# Altium schematic sheet RFID Reader Chip.SchDoc
size A3; SheetNumber: 5; SheetTotal: 8
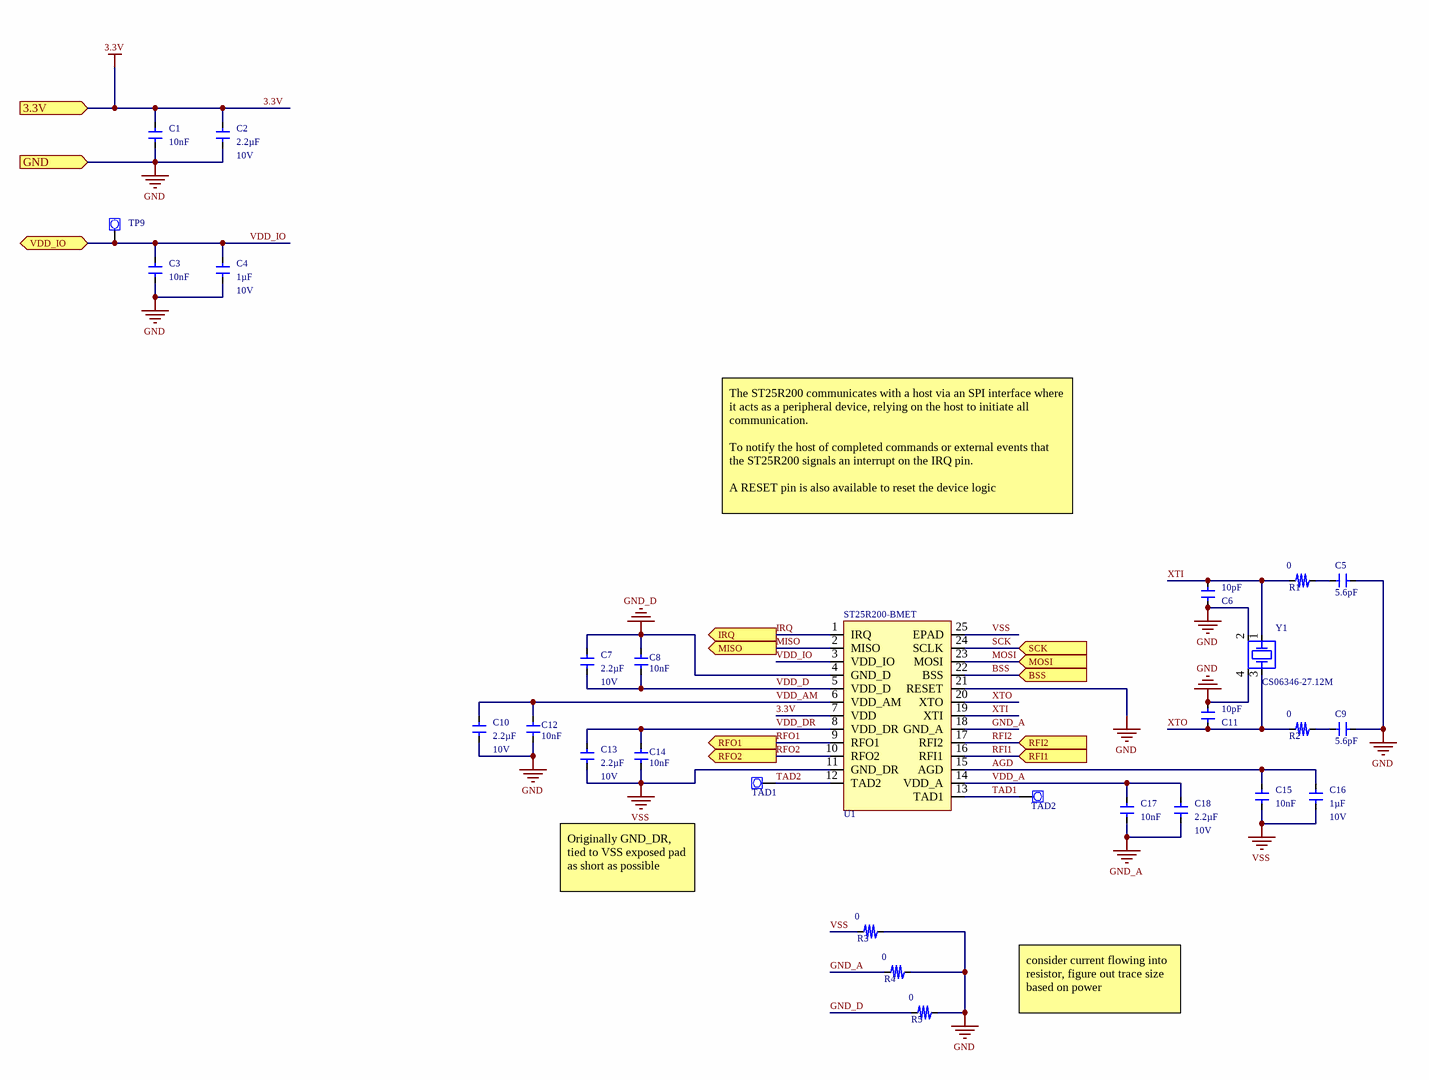
[diagram p0: RFID Reader Chip.SchDoc]

## Parts
?  (no value)  (graphical)
C1  value 10nF  [SYK-STD-CAP-0603]  (hidden comment: SYK-CAP-GEN-0.01uF-10%-X7R-16V-0603)
C2  value 2.2µF  Voltage Rating: 10V  [SYK-STD-CAP-0805 - NOSILK]  (hidden comment: C0805C225K8RACTU)
C3  value 10nF  [SYK-STD-CAP-0603]  (hidden comment: SYK-CAP-GEN-0.01uF-10%-X7R-16V-0603)
C4  value 1µF  Voltage Rating: 10V  [SYK-STD-CAP-0805 - NOSILK]  (hidden comment: CL21B105KPFNNNE)
C5  value 5.6pF  [SYK-STD-CAP-0201]  (hidden comment: GRM0335C1H5R6BA01D)
C6  value 10pF  [SYK-STD-CAP-0603]  (hidden comment: SYK-CAP-GEN-10pF-5%-C0G-50V-0603)
C7  value 2.2µF  Voltage Rating: 10V  [SYK-STD-CAP-0805 - NOSILK]  (hidden comment: C0805C225K8RACTU)
C8  value 10nF  [SYK-STD-CAP-0603]  (hidden comment: SYK-CAP-GEN-0.01uF-10%-X7R-16V-0603)
C9  value 5.6pF  [SYK-STD-CAP-0201]  (hidden comment: GRM0335C1H5R6BA01D)
C10  value 2.2µF  Voltage Rating: 10V  [SYK-STD-CAP-0805 - NOSILK]  (hidden comment: C0805C225K8RACTU)
C11  value 10pF  [SYK-STD-CAP-0603]  (hidden comment: SYK-CAP-GEN-10pF-5%-C0G-50V-0603)
C12  value 10nF  [SYK-STD-CAP-0603]  (hidden comment: SYK-CAP-GEN-0.01uF-10%-X7R-16V-0603)
C13  value 2.2µF  Voltage Rating: 10V  [SYK-STD-CAP-0805 - NOSILK]  (hidden comment: C0805C225K8RACTU)
C14  value 10nF  [SYK-STD-CAP-0603]  (hidden comment: SYK-CAP-GEN-0.01uF-10%-X7R-16V-0603)
C15  value 10nF  [SYK-STD-CAP-0603]  (hidden comment: SYK-CAP-GEN-0.01uF-10%-X7R-16V-0603)
C16  value 1µF  Voltage Rating: 10V  [SYK-STD-CAP-0805 - NOSILK]  (hidden comment: CL21B105KPFNNNE)
C17  value 10nF  [SYK-STD-CAP-0603]  (hidden comment: SYK-CAP-GEN-0.01uF-10%-X7R-16V-0603)
C18  value 2.2µF  Voltage Rating: 10V  [SYK-STD-CAP-0805 - NOSILK]  (hidden comment: C0805C225K8RACTU)
R1  value 0  [SYK-STD-RES-0603]  (hidden comment: ERJ3GEY0R00V)
R2  value 0  [SYK-STD-RES-0603]  (hidden comment: ERJ3GEY0R00V)
R3  value 0  [SYK-STD-RES-0603]  (hidden comment: ERJ3GEY0R00V)
R4  value 0  [SYK-STD-RES-0603]  (hidden comment: ERJ3GEY0R00V)
R5  value 0  [SYK-STD-RES-0603]  (hidden comment: ERJ3GEY0R00V)
TAD1  40 mil Circular Test Point Pad  [TESTPOINT_40]  (value not drawn)
TAD2  40 mil Circular Test Point Pad  [TESTPOINT_40]  (value not drawn)
TP9  40 mil Circular Test Point Pad  [TESTPOINT_40]  (value not drawn)
U1  ST25R200-BMET  [ST MICRO UFQFPN24]
Y1  CS06346-27.12M  [NDK 4-SMD]

## Ports
3.3V (in), BSS (in), GND (in), IRQ (out), MISO (out), MOSI (in), RFI1 (in), RFI2 (in), RFO1 (out), RFO2 (out), SCK (in), VDD_IO (bidir)

## Nets
3.3V: C1.2 C2.2 U1.7(VDD) ; port 3.3V
GND: C1.1 C2.1 C3.1 C4.1 C5.1 C6.1 C9.1 C10.1 C11.2 C12.1 R3.1 R4.1 R5.1 U1.21(RESET) Y1.2 Y1.4 ; port GND
GND_A: C17.1 C18.1 R4.2 U1.18(GND_A)
GND_D: C7.2 C8.1 R5.2 U1.4(GND_D)
VSS: C13.1 C14.1 C15.1 C16.1 R3.2 U1.11(GND_DR) U1.25(EPAD)
AGD: C15.2 C16.2 U1.15(AGD)
BSS: U1.22(BSS) ; port BSS
IRQ: U1.1(IRQ) ; port IRQ
MISO: U1.2(MISO) ; port MISO
MOSI: U1.23(MOSI) ; port MOSI
RFI1: U1.16(RFI1) ; port RFI1
RFI2: U1.17(RFI2) ; port RFI2
RFO1: U1.9(RFO1) ; port RFO1
RFO2: U1.10(RFO2) ; port RFO2
SCK: U1.24(SCLK) ; port SCK
TAD1: TAD2.1(TSTPNT) U1.13(TAD1)
TAD2: TAD1.1(TSTPNT) U1.12(TAD2)
VDD_A: C17.2 C18.2 U1.14(VDD_A)
VDD_AM: C10.2 C12.2 U1.6(VDD_AM)
VDD_D: C7.1 C8.2 U1.5(VDD_D)
VDD_DR: C13.2 C14.2 U1.8(VDD_DR)
VDD_IO: C3.2 C4.2 TP9.1(TSTPNT) U1.3(VDD_IO) ; port VDD_IO
XTI: C6.2 R1.2 U1.19(XTI) Y1.1
XTO: C11.1 R2.2 U1.20(XTO) Y1.3
NetC5_2: C5.2 R1.1
NetC9_2: C9.2 R2.1

## Notes on the sheet
- The ST25R200 communicates with a host via an SPI interface where it acts as a peripheral device, relying on the host to initiate all communication.
  To notify the host of completed commands or external events that the ST25R200 signals an interrupt on the IRQ pin.
  A RESET pin is also available to reset the device logic
- Originally GND_DR, tied to VSS exposed pad as short as possible
- consider current flowing into resistor, figure out trace size based on power
- LAYER NAME
- CRITICAL QUALITY ATTRIBUTE
- TITLE NAME
- THIS DRAWING CONTAINS CONFIDENTIAL INFORMATION AND IS ISSUED IN CONFIDENCE ON THE CONDITIONS
  THAT IT BE RETURNED ON DEMAND AND NOT BE COPIED, REPRODUCED, DISCLOSED TO OTHERS OR USED
  IN THE MANUFACTURE OF THE SUBJECT-MATTER THEREOF WITHOUT THE WRITTEN CONSENT OF
  STRYKER CORPORATION.
- SHALL BE COMPLIANT PER ES-1168 AND ES-1005
- SHEET
- OF
- NUMBER
- REV
- APPROVALS ARE FOUND IN PLM SYSTEM

## Library data of the parts
? = CMP-001-0000-v0.01.17: Stryker standard title block with pre-parameterized fields
C1 C3 C8 C12 C14 C15 C17 = CMP-001-00003-v0.01.05: Ceramic Capacitor, Multilayer, Ceramic, 16V, 10% +Tol, 10% -Tol, X7R, 15% TC, 0.01uF, Surface Mount, 0603; Manufacturer: Generic; Voltage Rating: 50V; Case/Package: 0603 (1608 Metric); Length: 1.6mm; Moisture Sensitivity Level: -; Operating Temperature - Min: -55°C; Width: 0.8mm; Height: 0.8mm; Reach Compliant: Unaffected; Capacitor Type: Ceramic; Tolerance: 10%; Temperature Coefficient: X7R; Manufacturer Part Number: Generic; Pins: 2; Ratings: -; RoHS Compliant: Yes; Operating Temperature - Max: 125°C; Mounting Technology: SMT; Critical Component: -
C2 C7 C10 C13 C18 = CMP-001-0753-v0.01.00: CAP CER 2.2UF 10V X7R 0805; Manufacturer: KEMET; Device Length: 2mm; Device Width: 1.25mm; Tolerance: 10%; Style Guide Revision: Librarian to Review; Capacitor Type: Ceramic; Mounting Technology: SMT; Moisture Sensitivity Level: 1; Ratings: -; Operating Temperature - Max: 125°C; Pins: 2; Case/Package: 0805 (2012 Metric); Temperature Coefficient: X7R; Critical Component: -; Manufacturer Part Number: C0805C225K8RACTU; REACH Compliant: Unaffected; Device Height: 1.25mm; Operating Temperature - Min: -55°C; RoHS Compliant: Yes
C4 C16 = CMP-001-0752-v0.01.00: CAP CER 1UF 10V X7R 0805; Manufacturer: Samsung Electro-Mechanics; Device Width: 1.25mm; Tolerance: 10%; Style Guide Revision: Librarian to Review; Device Height: 1.35mm; Device Length: 2mm; Capacitor Type: Ceramic; Mounting Technology: SMT; Pins: 2; Ratings: -; Temperature Coefficient: X7R; Moisture Sensitivity Level: 1; Case/Package: 0805 (2012 Metric); REACH Compliant: Unaffected; Critical Component: -; RoHS Compliant: Yes; Operating Temperature - Max: 125°C; Manufacturer Part Number: CL21B105KPFNNNE; Operating Temperature - Min: -55°C
C5 C9 = CMP-001-0278-v0.01.00: CAP CER 5.6PF 50V C0G/NP0 0201; Manufacturer: Murata Electronics; Device Height: 300µm; Tolerance: 0.1%; Style Guide Revision: Librarian to Review; Temperature Coefficient: C0G, NP0; Device Length: 600µm; Capacitor Type: Ceramic; Manufacturer Part Number: GRM0335C1H5R6BA01D; Operating Temperature - Max: 125°C; RoHS Compliant: Yes; Device Width: 300µm; Pins: 2; REACH Compliant: Unaffected; Ratings: -; Mounting Technology: Surface Mount; Moisture Sensitivity Level: 1; Critical Component: -; Voltage Rating: 50V; Case/Package: 0201 (0603 Metric); Operating Temperature - Min: -55°C
C6 C11 = CMP-00698-v0.01.02: CAP CER 10pF 5% C0G 50V 0603; Manufacturer: Generic; Device Width: 800µm; Style Guide Revision: AA; Device Length: 1.6mm; Capacitor Type: Ceramic; Voltage Rating: 50V; Mounting Technology: SMT; REACH Compliant: Unaffected; RoHS Compliant: Yes; Operating Temperature - Max: 125°C; Ratings: -; Temperature Coefficient: C0G; Operating Temperature - Min: -55°C; Case/Package: 0603; Tolerance: 5%; Pins: 2; Manufacturer Part Number: Generic; Moisture Sensitivity Level: 1; Critical Component: -; Device Height: 800µm
R1-R5 = CMP-001-0150-v0.01.08: RES SMD 0 OHM JUMPER 1/10W 0603; Manufacturer: PANASONIC (GENERIC); Style Guide Revision: AA; Device Width: 500µm; Tolerance: 0%; Power: 100mW; Device Length: 1mm; Device Height: 400µm; Operating Temperature - Max: 155°C; Manufacturer Part Number: ERJ3GEY0R00V; REACH Compliant: Unaffected; Mounting Technology: SMT; Pin Count: 2; Temperature Coefficient: -; Critical Component: -; Case/Package: 0603; Operating Temperature - Min: -55°C; RoHS Compliant: Yes
TAD1 TAD2 TP9 = CMP-001-0175-v0.01.07: Manufacturer: Stryker; Manufacturer Part Number: Copper Feature; Device Width: 0mm; Plating: 0; Test Point Signal Structure: Unknown; Test Point Is Used: X; Style Guide Revision: Librarian to Review; Critical Component: -; RoHS Compliance: Unknown; Material - Insulation: 0; Operating Temperature - Max: 0°C; Color: n/a; Device Height: 0mm; Operating Temperature - Min: 0°C; Hole Diameter: 0mm; Device Length: 0mm; Device Height Above Board: 0mm; Pin Count: 1; REACH Compliance: Unknown; Material - Body: 0; Mounting Technology: SMT
U1 = CMP-001-0762-v0.01.00: IC RFID READER 27.12MHZ 24-UFQFN; Manufacturer: STMicroelectronics; Voltage - Supply (Min): 2.7V; Device Height: 600µm; Voltage - Supply (Max): 5.5V; Style Guide Revision: Librarian to Review; Device Length: 4mm; Critical Component: -; Operating Temperature - Max: 125°C; Mounting Technology: SMT; Manufacturer Part Number: ST25R200-BMET; Case/Package: 24-UFQFN Exposed Pad; Operating Temperature - Min: -40°C; Pin Count: 25; Device Width: 4mm; REACH Compliant: Unaffected; Moisture Sensitivity Level: 1; RoHS Compliant: Yes
Y1 = CMP-001-0748-v0.01.00: CRYSTAL 27.1200MHZ 10PF SMD; Manufacturer: NDK (NIHON DEMPA KOGYO CO., LTD); ESR: 60; Frequency: 27.12MHz; Device Height: 0.50mm; Crystal Oscillation Mode: Fundamental; Device Length: 2.00mm; Style Guide Revision: Librarian to Review; Device Width: 1.60mm; Mounting Technology: SMT; RoHS Compliant: Unknown; Operating Temperature - Max: 125°C; Critical Component: -; Capacitance-  Load: 10pF; Pin Count: 4; Case/Package: 4-SMD, No Lead; Moisture Sensitivity Level: 1; Manufacturer Part Number: CS06346-27.12M; Operating Temperature - Min: -40°C; REACH Compliant: Unknown